# Altium schematic sheet Sheet1.SchDoc
size A4; SheetNumber: 1; SheetTotal: 1
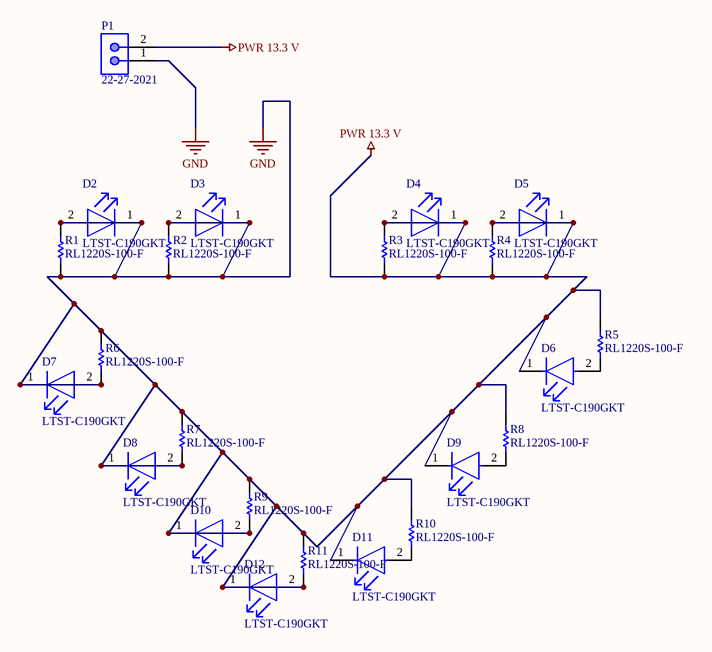
[diagram p0: Sheet1.SchDoc]

## Parts
D2  LTST-C190GKT  [FP-LTST-C190GKT-MFG]
D3  LTST-C190GKT  [FP-LTST-C190GKT-MFG]
D4  LTST-C190GKT  [FP-LTST-C190GKT-MFG]
D5  LTST-C190GKT  [FP-LTST-C190GKT-MFG]
D6  LTST-C190GKT  [FP-LTST-C190GKT-MFG]
D7  LTST-C190GKT  [FP-LTST-C190GKT-MFG]
D8  LTST-C190GKT  [FP-LTST-C190GKT-MFG]
D9  LTST-C190GKT  [FP-LTST-C190GKT-MFG]
D10  LTST-C190GKT  [FP-LTST-C190GKT-MFG]
D11  LTST-C190GKT  [FP-LTST-C190GKT-MFG]
D12  LTST-C190GKT  [FP-LTST-C190GKT-MFG]
P1  22-27-2021  [MOLX-22-27-2021_V]
R1  RL1220S-100-F  [RESC2013X50X40ML20T20]
R2  RL1220S-100-F  [RESC2013X50X40ML20T20]
R3  RL1220S-100-F  [RESC2013X50X40ML20T20]
R4  RL1220S-100-F  [RESC2013X50X40ML20T20]
R5  RL1220S-100-F  [RESC2013X50X40ML20T20]
R6  RL1220S-100-F  [RESC2013X50X40ML20T20]
R7  RL1220S-100-F  [RESC2013X50X40ML20T20]
R8  RL1220S-100-F  [RESC2013X50X40ML20T20]
R9  RL1220S-100-F  [RESC2013X50X40ML20T20]
R10  RL1220S-100-F  [RESC2013X50X40ML20T20]
R11  RL1220S-100-F  [RESC2013X50X40ML20T20]

## Nets
GND: D2.1(C) D2.2(A) D3.1(C) D3.2(A) D4.1(C) D4.2(A) D5.1(C) D5.2(A) D6.1(C) D7.1(C) D7.2(A) D8.1(C) D8.2(A) D9.1(C) D10.1(C) D10.2(A) D11.1(C) D12.1(C) D12.2(A) P1.1 P1.2 R1.1 R1.2 R2.1 R2.2 R3.1 R3.2 R4.1 R4.2 R5.1 R6.1 R6.2 R7.1 R7.2 R8.1 R9.1 R9.2 R10.1 R11.1 R11.2  [also labelled PWR 13.3 V]
NetD6_2: D6.2(A) R5.2
NetD9_2: D9.2(A) R8.2
NetD11_2: D11.2(A) R10.2

## Library data of the parts
D2-D12 = CMP-22017-000005-2: LED GREEN CLEAR CHIP SMD; Dominant Wavelength: 569nm; Reverse Voltage: 5V; Lens Color: Colorless; Viewing Angle: 130°; Voltage: 2V; Forward Current: 30mA; Power Dissipation: 100mW; Luminous Intensity: 6mcd; Number of LEDs: 1; Forward Voltage: 2.1V; Wavelength: 565nm; Test Current: 10mA; Min Operating Temperature: -55°C; Lens Style: Clear; Mount: Surface Mount; Width: 0.8mm; Packaging: Tape and Reel; Lens Transparency: Clear; Case Code (Metric): 1608; Depth: 0.8mm; Case Code (Imperial): 0603; Case/Package: 0603; Number of Pins: 2; Max Operating Temperature: 85°C; Lead Free: Lead Free; Number of Elements: 1; Length: 1.6mm; Height: 0.8mm; Package Quantity: 1; Power Rating: 100mW; Radiation Hardening: No; Illumination Color: Green; Color: Green
P1 = CMP-2000-05537-1: Male Header, Pitch 2.54 mm, 1 x 2 Position, Height 11.7 mm, Tail Length 3.56 mm, 0 to 75 degC, RoHS, Bulk; Manufacturer: Molex; PartNumber: 0022272021; Current rating: 4A; Package Version: Rev. BC, 02/2012; Voltage rating: 250V; No. of Positions: 2; Pitch: 2.54mm; No. of Rows: 1; Orientation: Vertical; Operating temperature: 0°Cto+75°C; Manufacturer URL: http://www.molex.com/; Mounting Technology: ThroughHole; Housing material: Nylon(UL94V-0); Package Description: 2-Leads Header, Body 5.08 x 5.8 mm, Pitch 2.54 mm; Voltage - Max: 250V; Datasheet URL: http://www.molex.com/pdm_docs/sd/022272021_sd.pdf; Package Reference: 22-27-2021; Contact material: Tinplatedbrass; Current - Max: 4A; Datasheet Version: Rev. F, 06/2009
R1-R11 = CMP-2001-03134-1: Manufacturer: Susumu; Part Number: RL1220S-100-F